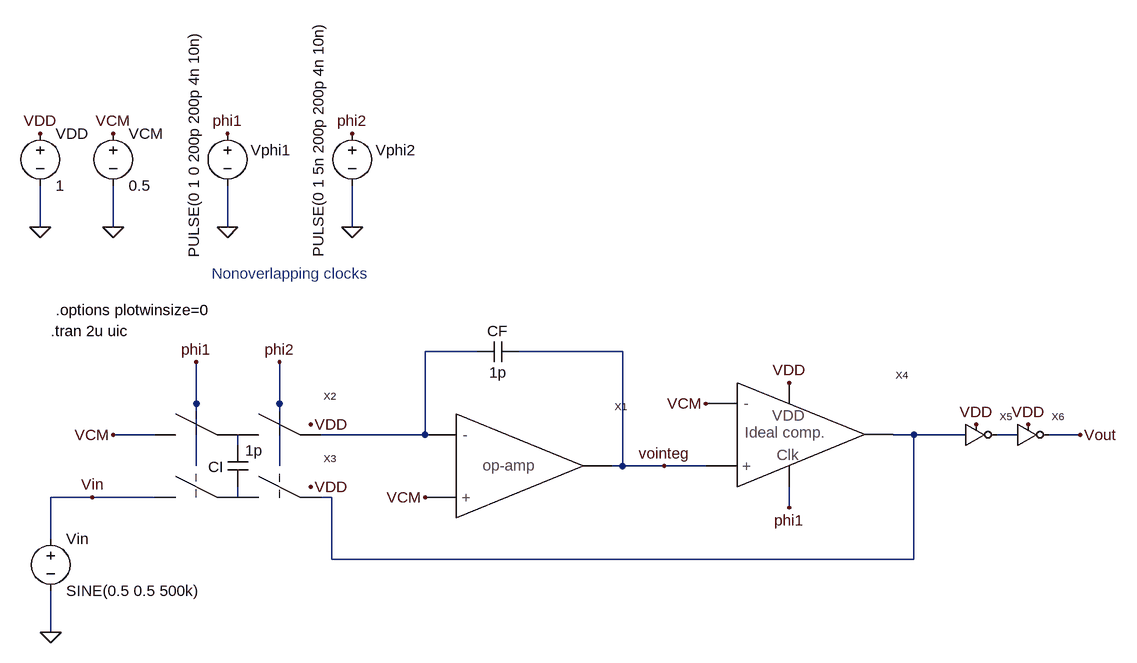
[diagram p0: schematic _Fig7_3_MSD.asc]
_Fig7_3_MSD.asc, the LTspice schematic file:
Version 4
SHEET 1 2740 696
WIRE 592 -704 592 -768
WIRE 704 -704 704 -768
WIRE 880 -704 880 -768
WIRE 1072 -704 1072 -768
WIRE 1264 -512 1184 -512
WIRE 1488 -512 1328 -512
WIRE 832 -432 832 -496
WIRE 960 -432 960 -496
WIRE 768 -384 704 -384
WIRE 1184 -384 1184 -512
WIRE 1184 -384 1024 -384
WIRE 1936 -384 1904 -384
WIRE 2016 -384 1936 -384
WIRE 2096 -384 2064 -384
WIRE 2192 -384 2144 -384
WIRE 896 -368 896 -384
WIRE 832 -336 832 -432
WIRE 960 -336 960 -432
WIRE 1488 -336 1488 -512
WIRE 1488 -336 1472 -336
WIRE 1552 -336 1488 -336
WIRE 1616 -336 1552 -336
WIRE 672 -288 608 -288
WIRE 768 -288 672 -288
WIRE 896 -288 896 -304
WIRE 1040 -288 1024 -288
WIRE 1744 -272 1744 -304
WIRE 608 -224 608 -288
WIRE 1040 -192 1040 -288
WIRE 1936 -192 1936 -384
WIRE 1936 -192 1040 -192
WIRE 608 -80 608 -144
FLAG 608 -80 0
FLAG 672 -288 Vin
FLAG 880 -704 0
FLAG 880 -848 phi1
FLAG 592 -704 0
FLAG 592 -848 VDD
FLAG 1008 -400 VDD
FLAG 1008 -304 VDD
FLAG 832 -496 phi1
FLAG 960 -496 phi2
FLAG 1184 -288 VCM
FLAG 704 -384 VCM
FLAG 1072 -704 0
FLAG 1072 -848 phi2
FLAG 704 -704 0
FLAG 704 -848 VCM
FLAG 1616 -432 VCM
FLAG 1744 -464 VDD
FLAG 1744 -272 phi1
FLAG 2192 -384 Vout
FLAG 1552 -336 vointeg
FLAG 2032 -400 VDD
FLAG 2112 -400 VDD
SYMBOL voltage 608 -240 R0
WINDOW 123 0 0 Left 0
WINDOW 39 0 0 Left 0
SYMATTR InstName Vin
SYMATTR Value SINE(0.5 0.5 500k)
SYMBOL voltage 880 -864 R0
WINDOW 0 36 42 Left 0
WINDOW 3 -52 207 VLeft 0
WINDOW 123 0 0 Left 0
WINDOW 39 0 0 Left 0
SYMATTR InstName Vphi1
SYMATTR Value PULSE(0 1 0 200p 200p 4n 10n)
SYMBOL voltage 592 -864 R0
WINDOW 123 0 0 Left 0
WINDOW 39 0 0 Left 0
SYMATTR InstName VDD
SYMATTR Value 1
SYMBOL switches_2 768 -368 R0
SYMATTR InstName X2
SYMBOL switches_2 768 -272 R0
SYMATTR InstName X3
SYMBOL cap 1264 -496 R270
WINDOW 0 32 32 VTop 0
WINDOW 3 0 32 VBottom 0
SYMATTR InstName CF
SYMATTR Value 1p
SYMBOL cap 880 -368 R0
WINDOW 0 -30 33 Left 0
WINDOW 3 27 8 Left 0
SYMATTR InstName CI
SYMATTR Value 1p
SYMBOL voltage 1072 -864 R0
WINDOW 0 36 42 Left 0
WINDOW 3 -52 207 VLeft 0
WINDOW 123 0 0 Left 0
WINDOW 39 0 0 Left 0
SYMATTR InstName Vphi2
SYMATTR Value PULSE(0 1 5n 200p 200p 4n 10n)
SYMBOL voltage 704 -864 R0
WINDOW 123 0 0 Left 0
WINDOW 39 0 0 Left 0
SYMATTR InstName VCM
SYMATTR Value 0.5
SYMBOL Ideal_clocked_comparator 1664 -384 R0
SYMATTR InstName X4
SYMBOL inverter 2016 -384 R0
SYMATTR InstName X5
SYMBOL inverter 2096 -384 R0
SYMATTR InstName X6
SYMBOL op_amp 1232 -336 R0
SYMATTR InstName X1
TEXT 608 -544 Left 0 !.tran 2u uic
TEXT 856 -632 Left 0 ;Nonoverlapping clocks
TEXT 616 -576 Left 0 !.options plotwinsize=0

The netlist it stands for:
* _Fig7_3_MSD.asc
Vin Vin 0 SINE(0.5 0.5 500k)
Vphi1 phi1 0 PULSE(0 1 0 200p 200p 4n 10n)
VDD VDD 0 1
XX2 VCM phi1 phi2 N001 VDD N004 switches_2  ; pins P1 clk1 Clk2 P3 VDD P2
XX3 Vin phi1 phi2 N002 VDD N005 switches_2  ; pins P1 clk1 Clk2 P3 VDD P2
CF N001 vointeg 1p
CI N004 N005 1p
Vphi2 phi2 0 PULSE(0 1 5n 200p 200p 4n 10n)
VCM VCM 0 0.5
XX4 VCM vointeg N002 VDD phi1 Ideal_clocked_comparator  ; pins Vinm Vinp Vout VDD Clock
XX5 N002 N003 VDD inverter  ; pins In Out VDD
XX6 N003 Vout VDD inverter  ; pins In Out VDD
XX1 N001 VCM vointeg op_amp  ; pins Vinm Vinp Out
.tran 2u uic
* Nonoverlapping clocks
.options plotwinsize=0
.backanno
.end